# Altium schematic sheet Channel_A.SchDoc
size OrCAD E; SheetNumber: 3; SheetTotal: 4
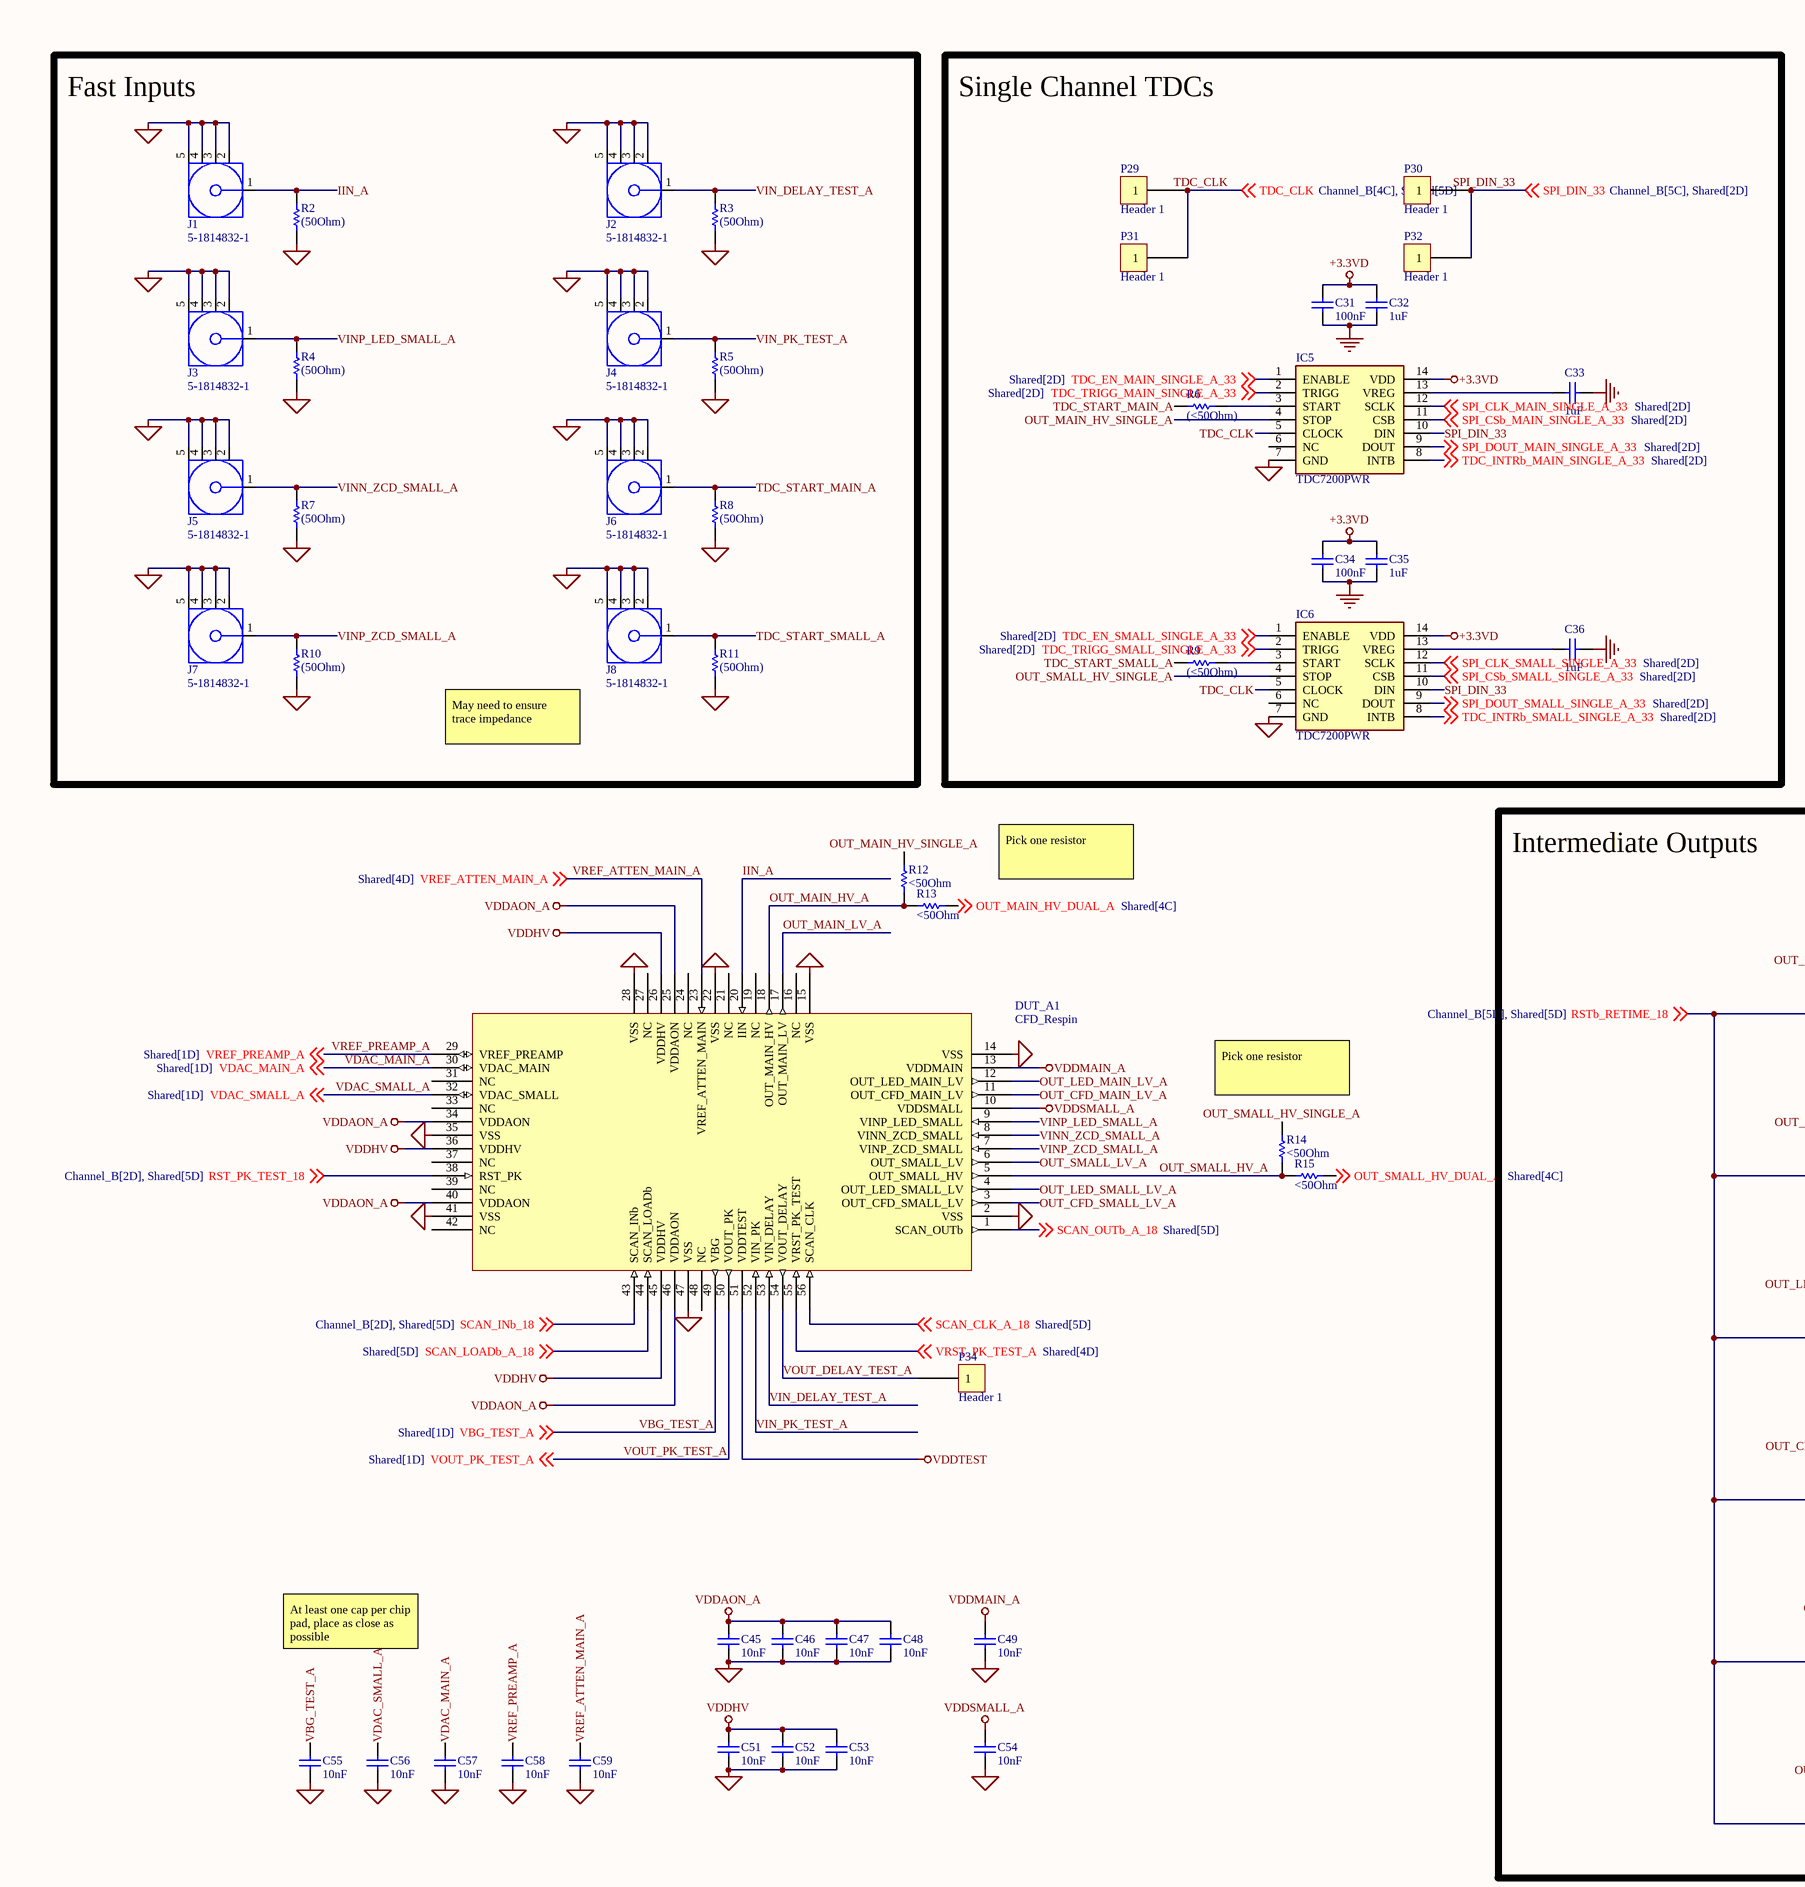
[diagram p0: Channel_A.SchDoc, left]
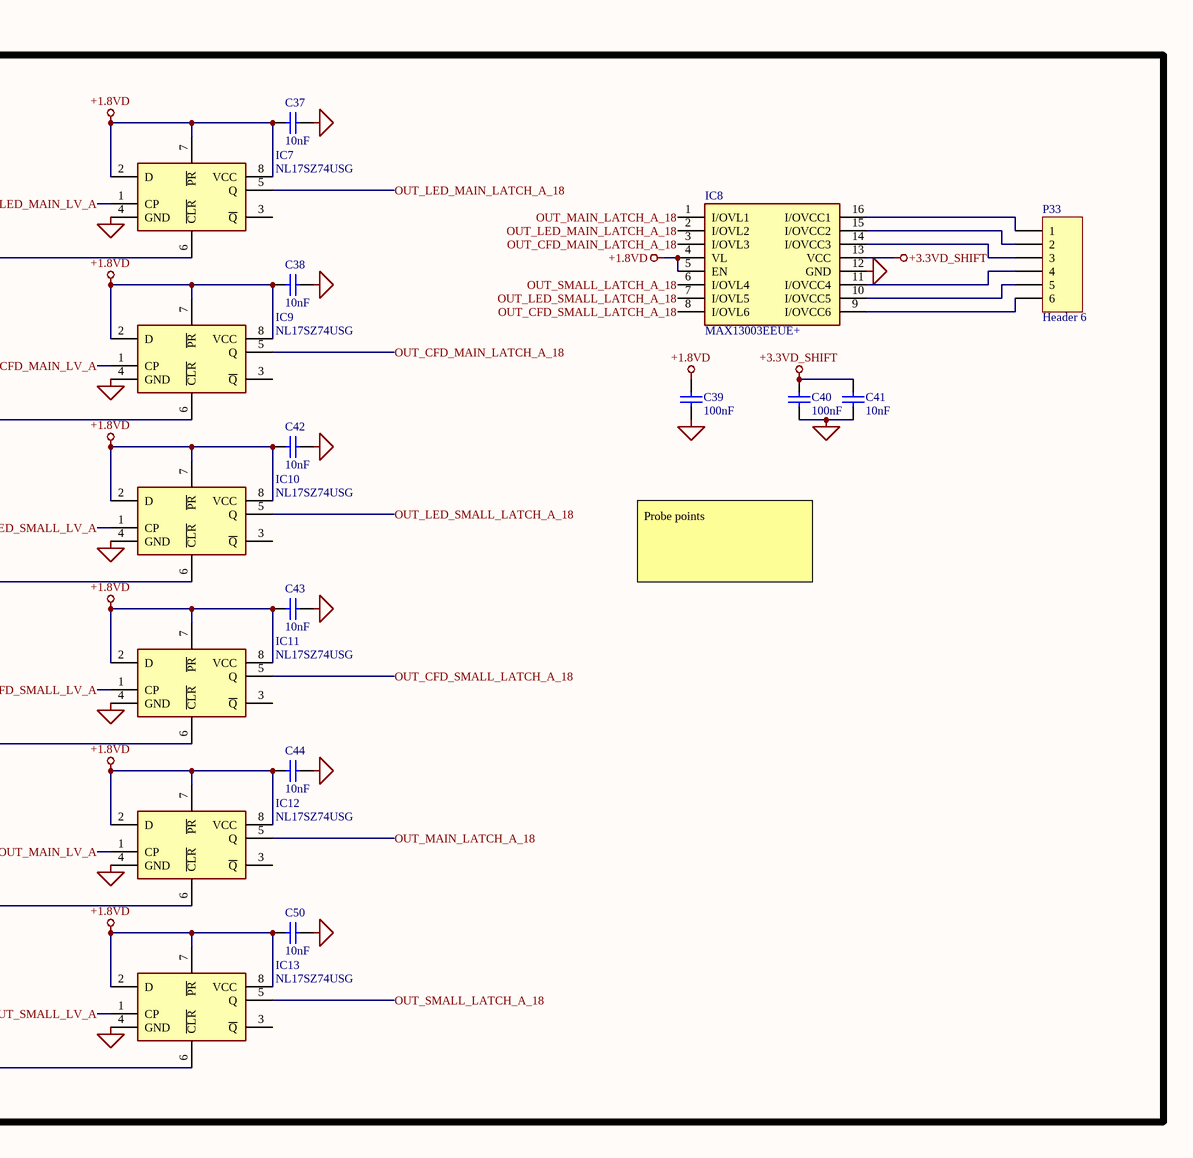
[diagram p1: Channel_A.SchDoc, right]

## Parts
C31  100nF  [CAPC1608X90X35ML10T15]
C32  1uF  [CAPC1608X90X35ML10T15]
C33  1uF  [CAPC1608X90X35ML10T15]
C34  100nF  [CAPC1608X90X35ML10T15]
C35  1uF  [CAPC1608X90X35ML10T15]
C36  1uF  [CAPC1608X90X35ML10T15]
C37  10nF  [CAPC1608X90X35ML10T15]
C38  10nF  [CAPC1608X90X35ML10T15]
C39  100nF  [CAPC1608X90X35ML10T15]
C40  100nF  [CAPC1608X90X35ML10T15]
C41  10nF  [CAPC1608X90X35ML10T15]
C42  10nF  [CAPC1608X90X35ML10T15]
C43  10nF  [CAPC1608X90X35ML10T15]
C44  10nF  [CAPC1608X90X35ML10T15]
C45  10nF  [CAPC1608X90X35ML10T15]
C46  10nF  [CAPC1608X90X35ML10T15]
C47  10nF  [CAPC1608X90X35ML10T15]
C48  10nF  [CAPC1608X90X35ML10T15]
C49  10nF  [CAPC1608X90X35ML10T15]
C50  10nF  [CAPC1608X90X35ML10T15]
C51  10nF  [CAPC1608X90X35ML10T15]
C52  10nF  [CAPC1608X90X35ML10T15]
C53  10nF  [CAPC1608X90X35ML10T15]
C54  10nF  [CAPC1608X90X35ML10T15]
C55  10nF  [CAPC1608X90X35ML10T15]
C56  10nF  [CAPC1608X90X35ML10T15]
C57  10nF  [CAPC1608X90X35ML10T15]
C58  10nF  [CAPC1608X90X35ML10T15]
C59  10nF  [CAPC1608X90X35ML10T15]
DUT_A1  CFD_Respin  [QFN50P800X800X80_HS-57N_WIDEVIAS]
IC5  TDC7200PWR  [SOP65P640X120-14N]
IC6  TDC7200PWR  [SOP65P640X120-14N]
IC7  NL17SZ74USG  [SOP50P310X90-8N]
IC8  MAX13003EEUE+  [SOP65P640X110-16N]
IC9  NL17SZ74USG  [SOP50P310X90-8N]
IC10  NL17SZ74USG  [SOP50P310X90-8N]
IC11  NL17SZ74USG  [SOP50P310X90-8N]
IC12  NL17SZ74USG  [SOP50P310X90-8N]
IC13  NL17SZ74USG  [SOP50P310X90-8N]
J1  5-1814832-1  [TECO-5-1814832-1_V]
J2  5-1814832-1  [TECO-5-1814832-1_V]
J3  5-1814832-1  [TECO-5-1814832-1_V]
J4  5-1814832-1  [TECO-5-1814832-1_V]
J5  5-1814832-1  [TECO-5-1814832-1_V]
J6  5-1814832-1  [TECO-5-1814832-1_V]
J7  5-1814832-1  [TECO-5-1814832-1_V]
J8  5-1814832-1  [TECO-5-1814832-1_V]
P29  Header 1  [Header1]
P30  Header 1  [Header1]
P31  Header 1  [Header1]
P32  Header 1  [Header1]
P33  Header 6  [HDR1X6]
P34  Header 1  [Header1]
R2  (50Ohm)  [RESC1609X50X30NL8T20]
R3  (50Ohm)  [RESC1609X50X30NL8T20]
R4  (50Ohm)  [RESC1609X50X30NL8T20]
R5  (50Ohm)  [RESC1609X50X30NL8T20]
R6  (<50Ohm)  [RESC1609X50X30NL8T20]
R7  (50Ohm)  [RESC1609X50X30NL8T20]
R8  (50Ohm)  [RESC1609X50X30NL8T20]
R9  (<50Ohm)  [RESC1609X50X30NL8T20]
R10  (50Ohm)  [RESC1609X50X30NL8T20]
R11  (50Ohm)  [RESC1609X50X30NL8T20]
R12  <50Ohm  [RESC1609X50X30NL8T20]
R13  <50Ohm  [RESC1609X50X30NL8T20]
R14  <50Ohm  [RESC1609X50X30NL8T20]
R15  <50Ohm  [RESC1609X50X30NL8T20]

## Blocks framed on the sheet
Fast Inputs: J1-J8 R2-R5 R7 R8 R10 R11
Single Channel TDCs: C31-C36 IC5 IC6 P29-P32 R6 R9
Intermediate Outputs: C37-C44 C50 IC7-IC13 P33

## Nets
+1.8VD: C37.2 C38.2 C39.2 C42.2 C43.2 C44.2 C50.2 IC7.2(D) IC7.7(~{PR}) IC7.8(VCC) IC8.4(VL) IC8.5(EN) IC9.2(D) IC9.7(~{PR}) IC9.8(VCC) IC10.2(D) IC10.7(~{PR}) IC10.8(VCC) IC11.2(D) IC11.7(~{PR}) IC11.8(VCC) IC12.2(D) IC12.7(~{PR}) IC12.8(VCC) IC13.2(D) IC13.7(~{PR}) IC13.8(VCC)
+3.3VD: C31.1 C32.1 C34.1 C35.1 IC5.14(VDD) IC6.14(VDD)
+3.3VD_SHIFT: C40.2 C41.2 IC8.13(VCC)
GND: C31.2 C32.2 C33.2 C34.2 C35.2 C36.2 C37.1 C38.1 C39.1 C40.1 C41.1 C42.1 C43.1 C44.1 C45.1 C46.1 C47.1 C48.1 C49.1 C50.1 C51.1 C52.1 C53.1 C54.1 C55.1 C56.1 C57.1 C58.1 C59.1 DUT_A1.2(VSS) DUT_A1.14(VSS) DUT_A1.15(VSS) DUT_A1.22(VSS) DUT_A1.28(VSS) DUT_A1.35(VSS) DUT_A1.41(VSS) DUT_A1.47(VSS) IC5.7(GND) IC6.7(GND) IC7.4(GND) IC8.12(GND) IC9.4(GND) IC10.4(GND) IC11.4(GND) IC12.4(GND) IC13.4(GND) J1.2 J1.3 J1.4 J1.5 J2.2 J2.3 J2.4 J2.5 J3.2 J3.3 J3.4 J3.5 J4.2 J4.3 J4.4 J4.5 J5.2 J5.3 J5.4 J5.5 J6.2 J6.3 J6.4 J6.5 J7.2 J7.3 J7.4 J7.5 J8.2 J8.3 J8.4 J8.5 R2.1 R3.1 R4.1 R5.1 R7.1 R8.1 R10.1 R11.1
VDDAON_A: C45.2 C46.2 C47.2 C48.2 DUT_A1.25(VDDAON) DUT_A1.34(VDDAON) DUT_A1.40(VDDAON) DUT_A1.46(VDDAON)
VDDHV: C51.2 C52.2 C53.2 DUT_A1.26(VDDHV) DUT_A1.36(VDDHV) DUT_A1.45(VDDHV)
VDDMAIN_A: C49.2 DUT_A1.13(VDDMAIN)
VDDSMALL_A: C54.2 DUT_A1.10(VDDSMALL)
VDDTEST: DUT_A1.51(VDDTEST)
IIN_A: DUT_A1.20(IIN) J1.1 R2.2
OUT_CFD_MAIN_LATCH_A_18: IC8.3(I/OVL3) IC9.5(Q)
OUT_CFD_MAIN_LV_A: DUT_A1.11(OUT_CFD_MAIN_LV) IC9.1(CP)
OUT_CFD_SMALL_LATCH_A_18: IC8.8(I/OVL6) IC11.5(Q)
OUT_CFD_SMALL_LV_A: DUT_A1.3(OUT_CFD_SMALL_LV) IC11.1(CP)
OUT_LED_MAIN_LATCH_A_18: IC7.5(Q) IC8.2(I/OVL2)
OUT_LED_MAIN_LV_A: DUT_A1.12(OUT_LED_MAIN_LV) IC7.1(CP)
OUT_LED_SMALL_LATCH_A_18: IC8.7(I/OVL5) IC10.5(Q)
OUT_LED_SMALL_LV_A: DUT_A1.4(OUT_LED_SMALL_LV) IC10.1(CP)
OUT_MAIN_HV_A: DUT_A1.18(OUT_MAIN_HV) R12.2 R13.1
OUT_MAIN_HV_DUAL_A: R13.2 ; off-sheet OUT_MAIN_HV_DUAL_A
OUT_MAIN_HV_SINGLE_A: IC5.4(STOP) R12.1
OUT_MAIN_LATCH_A_18: IC8.1(I/OVL1) IC12.5(Q)
OUT_MAIN_LV_A: DUT_A1.17(OUT_MAIN_LV) IC12.1(CP)
OUT_SMALL_HV_A: DUT_A1.5(OUT_SMALL_HV) R14.2 R15.1
OUT_SMALL_HV_DUAL_A: R15.2 ; off-sheet OUT_SMALL_HV_DUAL_A
OUT_SMALL_HV_SINGLE_A: IC6.4(STOP) R14.1
OUT_SMALL_LATCH_A_18: IC8.6(I/OVL4) IC13.5(Q)
OUT_SMALL_LV_A: DUT_A1.6(OUT_SMALL_LV) IC13.1(CP)
RST_PK_TEST_18: DUT_A1.38(RST_PK) ; off-sheet RST_PK_TEST_18
RSTb_RETIME_18: IC7.6(~{CLR}) IC9.6(~{CLR}) IC10.6(~{CLR}) IC11.6(~{CLR}) IC12.6(~{CLR}) IC13.6(~{CLR}) ; off-sheet RSTb_RETIME_18
SCAN_CLK_A_18: DUT_A1.56(SCAN_CLK) ; off-sheet SCAN_CLK_A_18
SCAN_INb_18: DUT_A1.43(SCAN_INb) ; off-sheet SCAN_INb_18
SCAN_LOADb_A_18: DUT_A1.44(SCAN_LOADb) ; off-sheet SCAN_LOADb_A_18
SCAN_OUTb_A_18: DUT_A1.1(SCAN_OUTb) ; off-sheet SCAN_OUTb_A_18
SPI_CLK_MAIN_SINGLE_A_33: IC5.12(SCLK) ; off-sheet SPI_CLK_MAIN_SINGLE_A_33
SPI_CLK_SMALL_SINGLE_A_33: IC6.12(SCLK) ; off-sheet SPI_CLK_SMALL_SINGLE_A_33
SPI_CSb_MAIN_SINGLE_A_33: IC5.11(CSB) ; off-sheet SPI_CSb_MAIN_SINGLE_A_33
SPI_CSb_SMALL_SINGLE_A_33: IC6.11(CSB) ; off-sheet SPI_CSb_SMALL_SINGLE_A_33
SPI_DIN_33: IC5.10(DIN) IC6.10(DIN) P30.1 P32.1 ; off-sheet SPI_DIN_33
SPI_DOUT_MAIN_SINGLE_A_33: IC5.9(DOUT) ; off-sheet SPI_DOUT_MAIN_SINGLE_A_33
SPI_DOUT_SMALL_SINGLE_A_33: IC6.9(DOUT) ; off-sheet SPI_DOUT_SMALL_SINGLE_A_33
TDC_CLK: IC5.5(CLOCK) IC6.5(CLOCK) P29.1 P31.1 ; off-sheet TDC_CLK
TDC_EN_MAIN_SINGLE_A_33: IC5.1(ENABLE) ; off-sheet TDC_EN_MAIN_SINGLE_A_33
TDC_EN_SMALL_SINGLE_A_33: IC6.1(ENABLE) ; off-sheet TDC_EN_SMALL_SINGLE_A_33
TDC_INTRb_MAIN_SINGLE_A_33: IC5.8(INTB) ; off-sheet TDC_INTRb_MAIN_SINGLE_A_33
TDC_INTRb_SMALL_SINGLE_A_33: IC6.8(INTB) ; off-sheet TDC_INTRb_SMALL_SINGLE_A_33
TDC_START_MAIN_A: J6.1 R6.1 R8.2
TDC_START_SMALL_A: J8.1 R9.1 R11.2
TDC_TRIGG_MAIN_SINGLE_A_33: IC5.2(TRIGG) ; off-sheet TDC_TRIGG_MAIN_SINGLE_A_33
TDC_TRIGG_SMALL_SINGLE_A_33: IC6.2(TRIGG) ; off-sheet TDC_TRIGG_SMALL_SINGLE_A_33
VBG_TEST_A: C55.2 DUT_A1.49(VBG) ; off-sheet VBG_TEST_A
VDAC_MAIN_A: C57.2 DUT_A1.30(VDAC_MAIN) ; off-sheet VDAC_MAIN_A
VDAC_SMALL_A: C56.2 DUT_A1.32(VDAC_SMALL) ; off-sheet VDAC_SMALL_A
VIN_DELAY_TEST_A: DUT_A1.53(VIN_DELAY) J2.1 R3.2
VIN_PK_TEST_A: DUT_A1.52(VIN_PK) J4.1 R5.2
VINN_ZCD_SMALL_A: DUT_A1.8(VINN_ZCD_SMALL) J5.1 R7.2
VINP_LED_SMALL_A: DUT_A1.9(VINP_LED_SMALL) J3.1 R4.2
VINP_ZCD_SMALL_A: DUT_A1.7(VINP_ZCD_SMALL) J7.1 R10.2
VOUT_DELAY_TEST_A: DUT_A1.54(VOUT_DELAY) P34.1
VOUT_PK_TEST_A: DUT_A1.50(VOUT_PK) ; off-sheet VOUT_PK_TEST_A
VREF_ATTEN_MAIN_A: C59.2 DUT_A1.23(VREF_ATTEN_MAIN) ; off-sheet VREF_ATTEN_MAIN_A
VREF_PREAMP_A: C58.2 DUT_A1.29(VREF_PREAMP) ; off-sheet VREF_PREAMP_A
VRST_PK_TEST_A: DUT_A1.55(VRST_PK_TEST) ; off-sheet VRST_PK_TEST_A
NetC33_1: C33.1 IC5.13(VREG)
NetC36_1: C36.1 IC6.13(VREG)
NetIC5_3: IC5.3(START) R6.2
NetIC6_3: IC6.3(START) R9.2
NetIC8_9: IC8.9(I/OVCC6) P33.6
NetIC8_10: IC8.10(I/OVCC5) P33.5
NetIC8_11: IC8.11(I/OVCC4) P33.4
NetIC8_14: IC8.14(I/OVCC3) P33.3
NetIC8_15: IC8.15(I/OVCC2) P33.2
NetIC8_16: IC8.16(I/OVCC1) P33.1

Not connected (* = marked no-connect by the designer): DUT_A1 16(NC) 19(NC) 21(NC) 24(NC) 27(NC) 31(NC) 33(NC) 37(NC) 39(NC) 42(NC) 48(NC); IC5 6(NC); IC6 6(NC); IC7 3(~{Q}); IC9 3(~{Q}); IC10 3(~{Q}); IC11 3(~{Q}); IC12 3(~{Q}); IC13 3(~{Q})

## Notes on the sheet
- May need to ensure trace impedance
- Pick one resistor
- (near R14) Pick one resistor
- Probe points
- At least one cap per chip pad, place as close as possible

## Library data of the parts
C31-C59 = CMP-2000-04945-1: 0603; Manufacturer: Murata; Capacitance: 22pF; Tolerance (%): ±5%; Rated Voltage: 50V; Dielectric: C0G; Manufacturer URL: http://www.murata.com/; Datasheet Version: Jul-06; Package Reference: 603; Case Size/Dimension: 0603; Package Description: 2-Pin Surface Mount Device, Body 1.6 x 0.8 mm; Datasheet URL: https://datasheet.ciiva.com/11786/0900766b807a1cab-11786398.pdf
IC5 IC6 = TDC7200PWR: Integrated Circuit; Manufacturer_Name: Texas Instruments; Datasheet Link: http://www.ti.com/lit/gpn/tdc7200; Height: 1.2mm; Manufacturer_Part_Number: TDC7200PWR
IC7 IC9-IC13 = NL17SZ74USG: Flip Flops 1.65-5.5V CMOS Single D-Type; Manufacturer_Name: ON Semiconductor; Datasheet Link: http://www.onsemi.com/pub/Collateral/NL17SZ74-D.PDF; Height: 0.9mm; Manufacturer_Part_Number: NL17SZ74USG
IC8 = MAX13003EEUE+: Integrated Circuit; Manufacturer_Name: Maxim Integrated; Datasheet Link: https://pdfserv.maximintegrated.com/en/ds/MAX13000E-MAX13005E.pdf; Height: 1.1mm; Manufacturer_Part_Number: MAX13003EEUE+
J1-J8 = CMP-2000-05415-1: SMA Connector, Pitch 5.08 mm, 1 Position, Height 9.5 mm, Tail Length 4 mm, -65 to 165 degC, RoHS, Bulk; Manufacturer: TE Connectivity; Connector Mounting: PCBMount; Connector Body Style: StraightJack; Impedance: 50ohm; Coaxial Termination: Solder; SVHC: NoSVHC(15-Jun-2015); Frequency Max: 3GHz; Product Range: ZDCSeries; Connector Type: SMACoaxial; Datasheet Version: Rev. B1, 03/2011; Package Reference: 5-1814832-1; Package Description: SMA Connector, Pitch 5.08 mm, 1 Position, Height 9.5 mm, Tail Length 4 mm; Contact Plating: GoldPlatedContacts; Coaxial Cable Types: -; Contact Material: BerylliumCopper; Manufacturer URL: http://www.te.com/; Datasheet URL: http://www.onlinecomponents.com/productFiles/mf-AMP/eng_cd_1814832_a.pdf
P33 = Header 6: Header, 6-Pin; LatestRevisionDate: 17-Jul-2002; LatestRevisionNote: Re-released for DXP Platform.; Publisher: Altium Limited
R2-R15 = CMP-2000-03816-5: 0603; Manufacturer: Vishay Semiconductor; Voltage Rating: 75 V; Package Quantity: 5000; DatasheetVersion: 06/2012; Min Operating Temperature: -55 degC; ComponentLink1URL: http://www.vishay.com/; Mounting Technology: Surface Mount; Height: 0.45 mm; ComponentLink1Description: Manufacturer URL; REACH SVHC: Unknown; PackageReference: 0603; Packaging: Tape and Reel; Max Operating Temperature: 155 degC; Mount: Surface Mount; ComponentLink2Description: Datasheet; PackageDescription: 2-Pin Surface Mount Device, Body 1.575 x 0.85 mm; Length: 1.55 mm; ComponentLink2URL: http://www.vishay.com/docs/20035/dcrcwe3.pdf; Pins: 2; RoHSCompliant: true